# EAGLE design ProtoShieldShort (EAGLE 6.3)
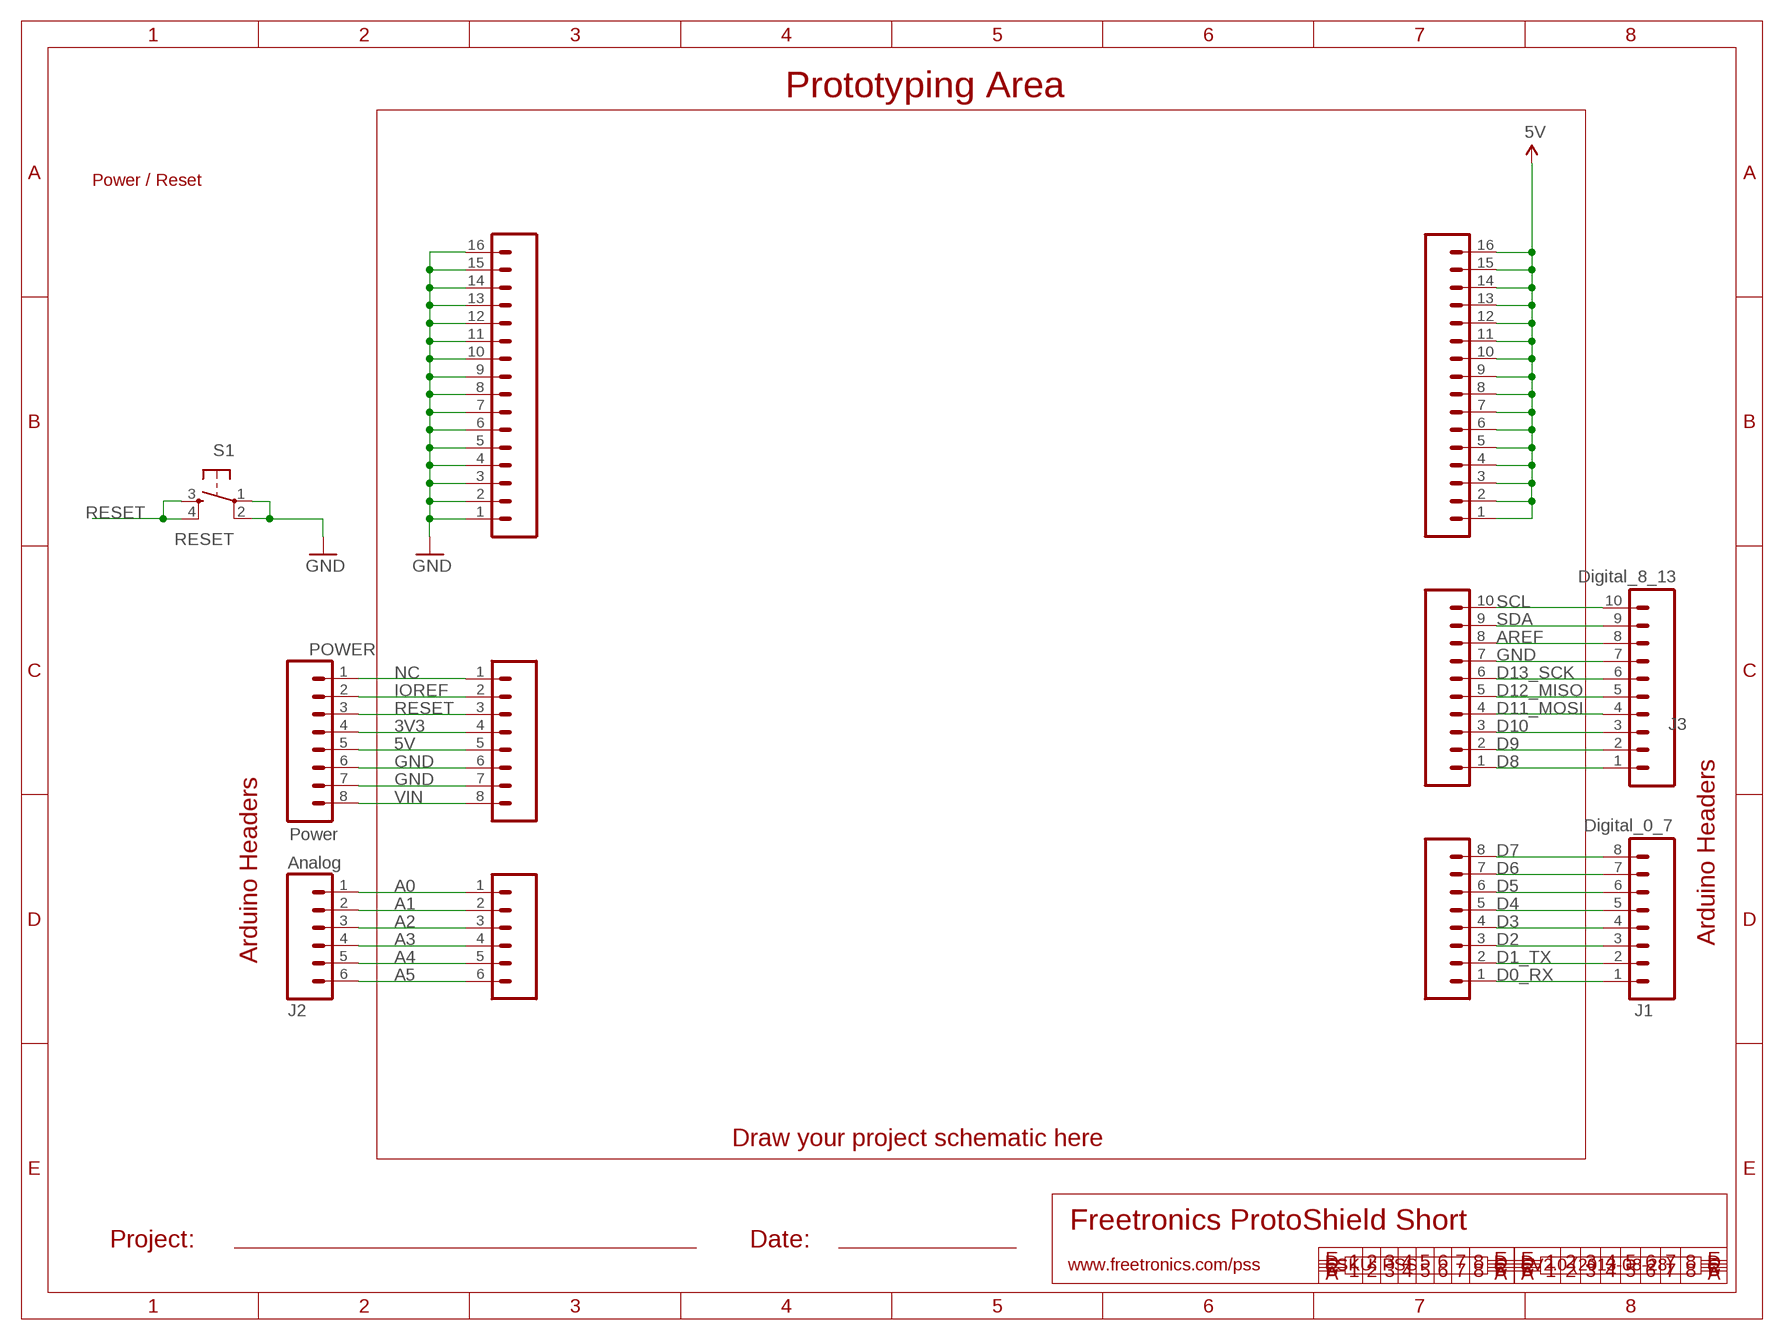
[diagram p0: schematic, sheet 1]

## Parts
J1  Digital_0_7  M08  [1X08]
J2  Analog  M06SIP  [1X06]
J3  Digital_8_13  M100.1  [1X10]
PADS_5V  M16PTH  [1X16]
PADS_GND  M16PTH  [1X16]
POWER  Power  M08  [1X08]
S1  RESET  TAC_SWITCHPTH  [TACTILE-PTH]
SL1  Digital_0_7  M08  [1X08]
SL2  Analog  M06SIP  [1X06]
SL3  Digital_8_13  M100.1  [1X10]
SLP  Power  M08  [1X08]

## Nets
3V3: POWER.4 SLP.4
5V: PADS_5V.1 PADS_5V.2 PADS_5V.3 PADS_5V.4 PADS_5V.5 PADS_5V.6 PADS_5V.7 PADS_5V.8 PADS_5V.9 PADS_5V.10 PADS_5V.11 PADS_5V.12 PADS_5V.13 PADS_5V.14 PADS_5V.15 PADS_5V.16 POWER.5 SLP.5
A0: J2.1 SL2.1
A1: J2.2 SL2.2
A2: J2.3 SL2.3
A3: J2.4 SL2.4
A4: J2.5 SL2.5
A5: J2.6 SL2.6
AREF: J3.8 SL3.8
D0_RX: J1.1 SL1.1
D1_TX: J1.2 SL1.2
D2: J1.3 SL1.3
D3: J1.4 SL1.4
D4: J1.5 SL1.5
D5: J1.6 SL1.6
D6: J1.7 SL1.7
D7: J1.8 SL1.8
D8: J3.1 SL3.1
D9: J3.2 SL3.2
D10: J3.3 SL3.3
D11_MOSI: J3.4 SL3.4
D12_MISO: J3.5 SL3.5
D13_SCK: J3.6 SL3.6
GND: J3.7 PADS_GND.1 PADS_GND.2 PADS_GND.3 PADS_GND.4 PADS_GND.5 PADS_GND.6 PADS_GND.7 PADS_GND.8 PADS_GND.9 PADS_GND.10 PADS_GND.11 PADS_GND.12 PADS_GND.13 PADS_GND.14 PADS_GND.15 PADS_GND.16 POWER.6 POWER.7 S1.1 S1.2 SL3.7 SLP.6 SLP.7
IOREF: POWER.2 SLP.2
NC: POWER.1 SLP.1
RESET: POWER.3 S1.3 S1.4 SLP.3
SCL: J3.10 SL3.10
SDA: J3.9 SL3.9
VIN: POWER.8 SLP.8

## Notes on the sheet
- Prototyping Area
- Power / Reset
- Arduino Headers
- Arduino Headers
- Draw your project schematic here
- Freetronics ProtoShield Short
- Project: | Date:
- www.freetronics.com/pss | SKU: PSS | V2.0 (2013-08-28)

## Library data of the parts
J1 POWER SL1 SLP = freetronics:M08: Header 8 Standard 8-pin 0.1" header. Use with straight break away headers (SKU : PRT-00116), right angle break away headers (PRT-00553), swiss pins (PRT-00743), machine pins (PRT-00117), and female headers (PRT-00115).
J2 SL2 = freetronics:M06: Header 6 Standard 6-pin 0.1" header. Use with straight break away headers (SKU : PRT-00116), right angle break away headers (PRT-00553), swiss pins (PRT-00743), machine pins (PRT-00117), and female headers (PRT-00115). Molex polarized connector foot print use with SKU : PRT-08094 with associated crimp pins and housings. NOTES ON THE VARIANTS LOCK and LOCK_LONGPADS... This footprint was designed to help hold the alignment of a through-hole component (i.e. 6-pin header) while soldering it into place. You may notice that each hole has been shifted either up or down by 0.005 of an inch from it's more standard position (which is a perfectly straight line). This slight alteration caused the pins (the squares in the middle) to touch the edges of the holes. Because they are alternating, it causes a "brace" to hold the component in place. 0.005 has proven to be the perfect amount of "off-center" position when using our standard breakaway headers. Although looks a little odd when you look at the bare footprint, once you have a header in there, the alteration is very hard to notice. Also, if you push a header all the way into place, it is covered up entirely on the bottom side. This idea of altering the position of holes to aid alignment will be further integrated into the Sparkfun Library for other footprints. It can help hold any component with 3 or more connection pins.
J3 SL3 = freetronics-original:M10: Header 10 Standard 10-pin 0.1" header. Use with straight break away headers (SKU : PRT-00116), right angle break away headers (PRT-00553), swiss pins (PRT-00743), machine pins (PRT-00117), and female headers (PRT-00115).
PADS_5V PADS_GND = freetronics-original:M16
S1 = freetronics:TAC_SWITCH: Momentary Switch Button commonly used for reset or general input. Spark Fun Electronics SKU : COM-00097

## Board
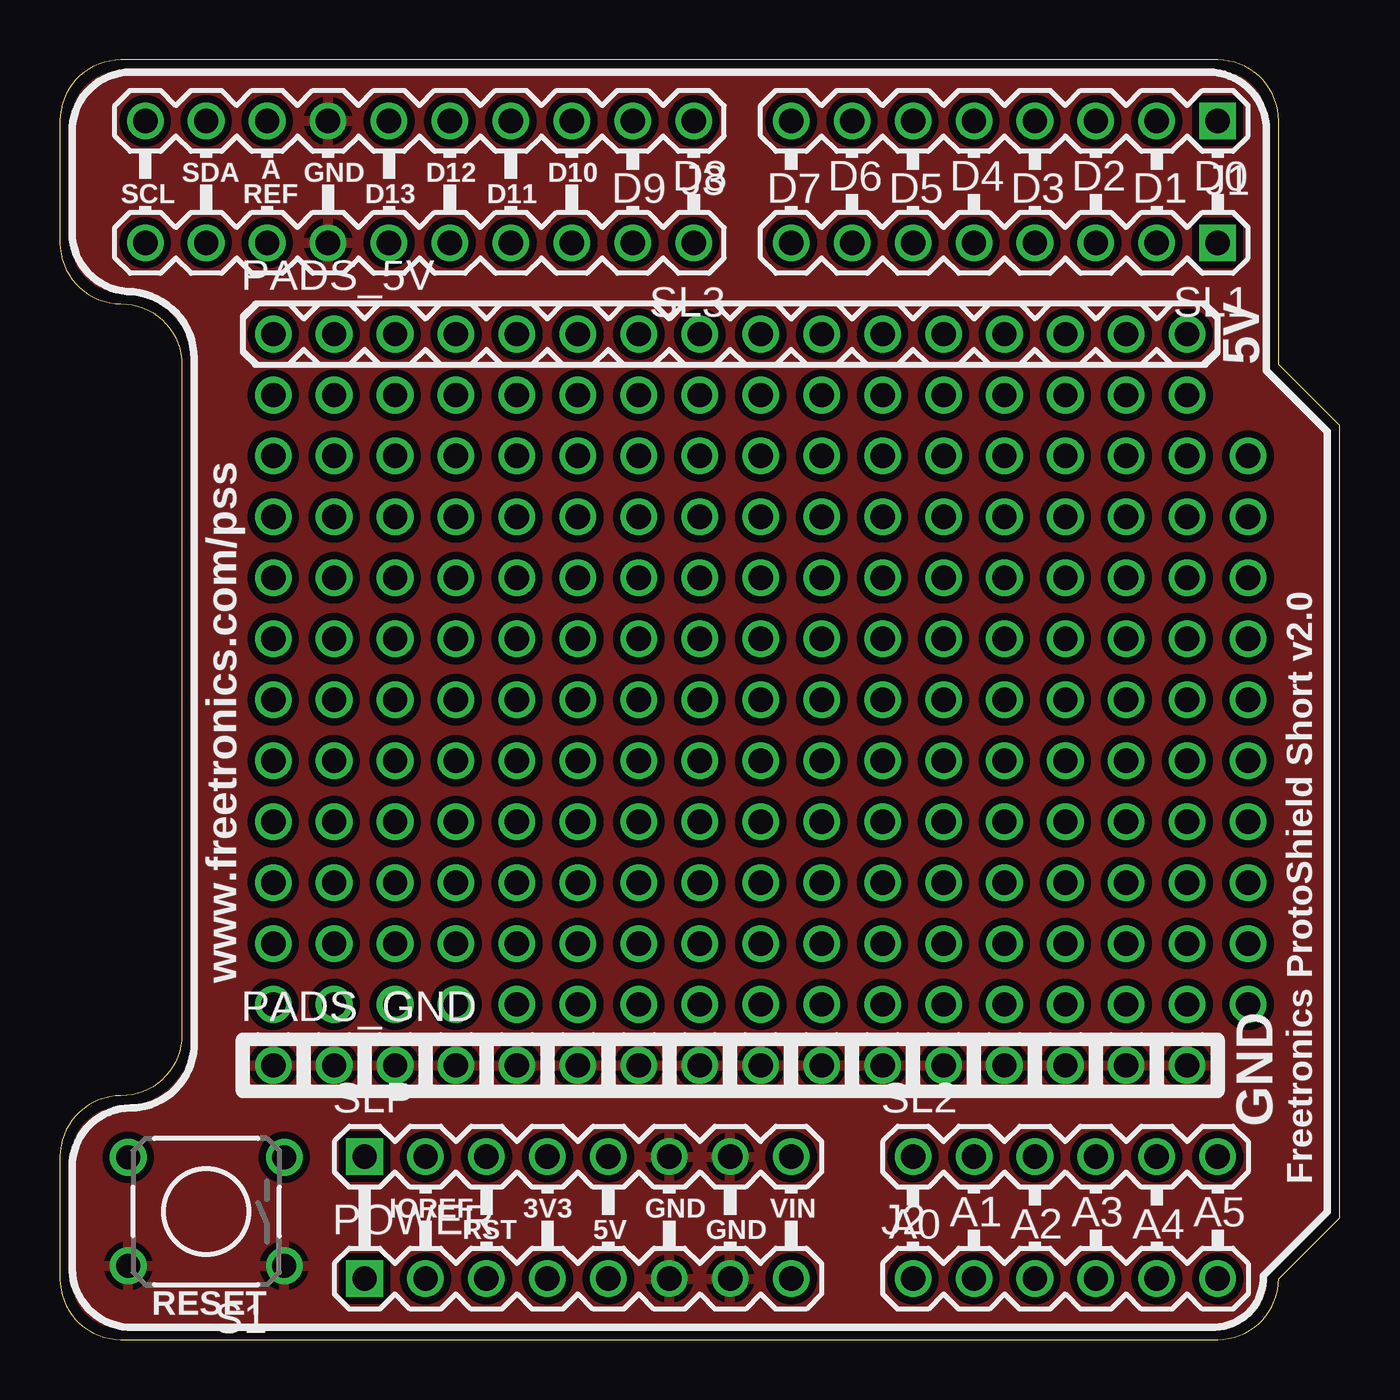
[diagram p1: board, top side]
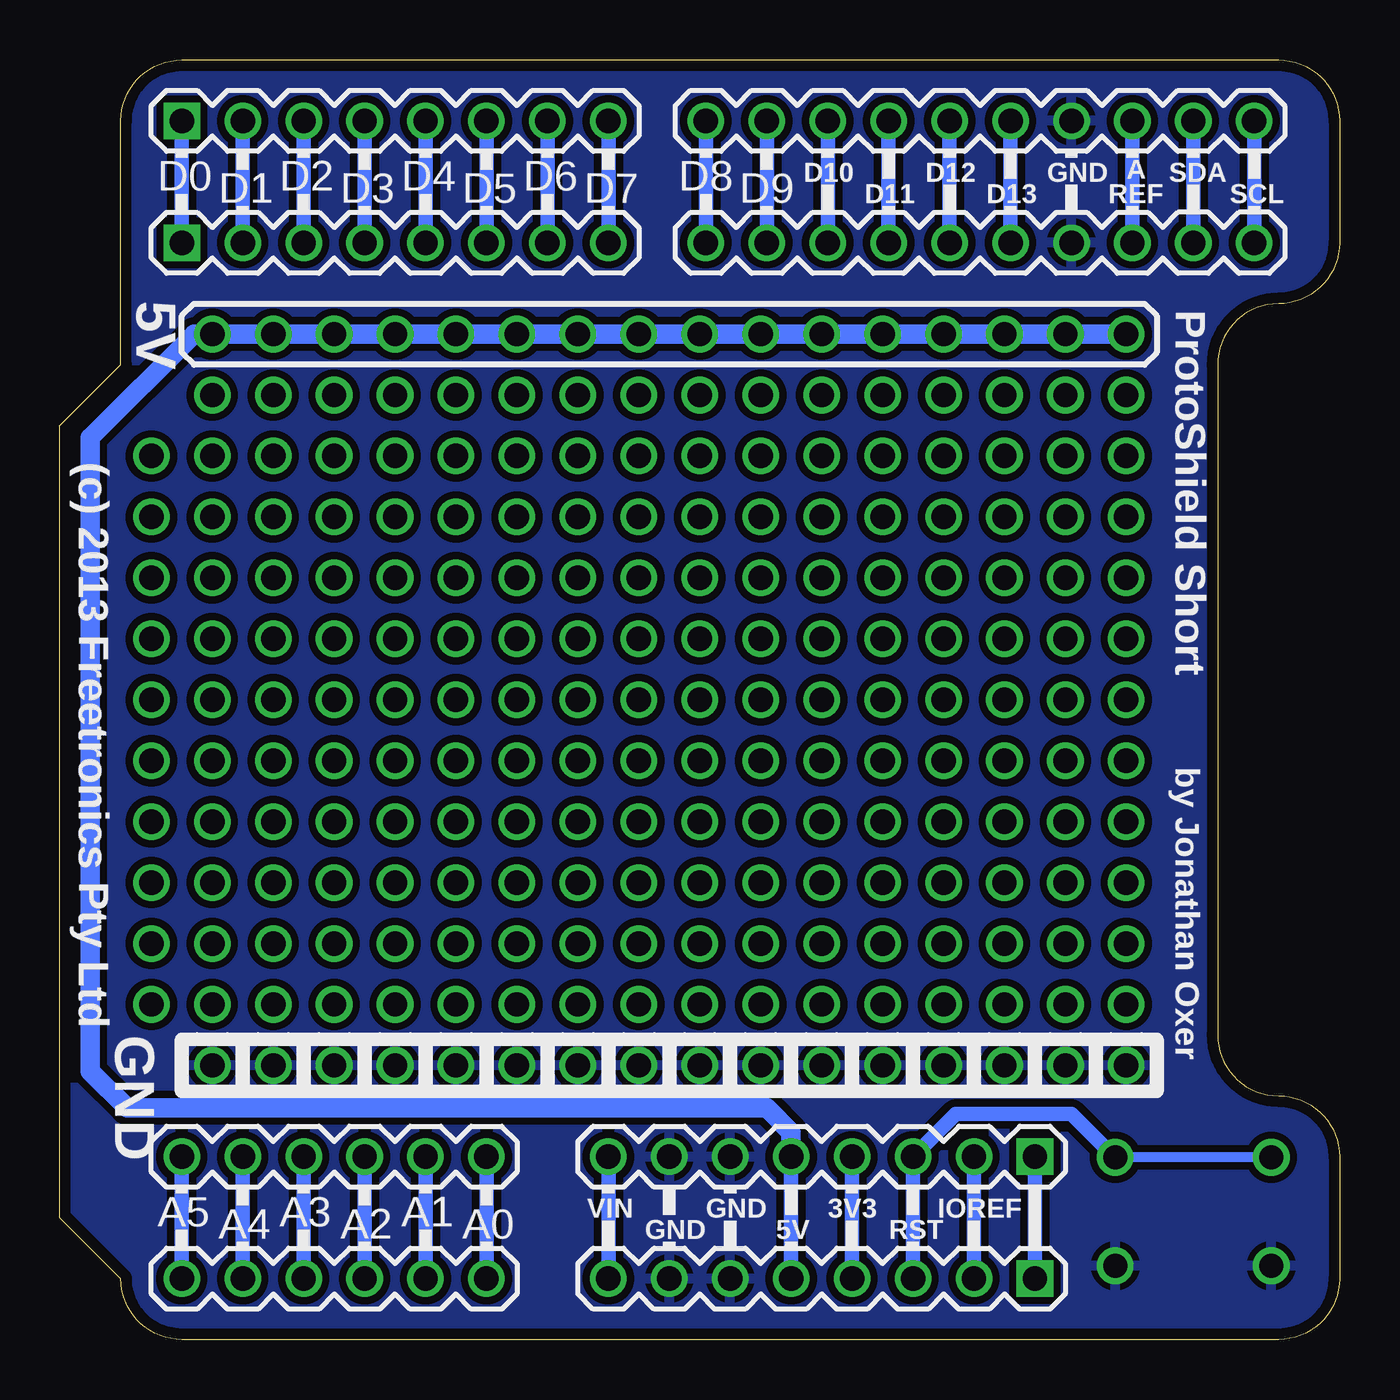
[diagram p2: board, bottom side, seen from below]

Size 53.34 x 53.34 mm. Coordinates in mm from the lower left corner, seen from the top.
Outline: 0,2.54 arc90 2.54,0 48.26,0 arc90 50.8,2.54 53.34,5.08 53.34,38.1 50.8,40.64 50.8,50.8 arc90 48.26,53.34 2.54,53.34 arc90 0,50.8 0,45.72 arc90 2.54,43.18 arc-90 5.08,40.64 5.08,12.7 arc-90 2.54,10.16 arc90 0,7.62 0,2.54
Copper layers (1*16): Top 0.035mm / dielectric 1.5mm / Bottom 0.035mm
Design rules "default *": minimum track width 10mil, minimum drill 24mil, track to track 12mil, track to pad 12mil, pad to pad 12mil, via to via 12mil, smd to smd 8mil, copper to edge 18mil, drill to drill 8mil, minimum pad ring 10mil, minimum via ring 8mil, stop-mask expansion 4mil, vias tented up to drill 0mil, thermal gap 10mil

### Footprints (pad centres in the part's own frame; a part is rotated, then mirrored left to right if it is on the bottom)
1X08 = drill 1.016 square: 1 0,0 | drill 1.016: 2 2.54,0; 3 5.08,0; 4 7.62,0; 5 10.16,0; 6 12.7,0; 7 15.24,0; 8 17.78,0
1X06 = drill 1.016: 1 0,0; 2 2.54,0; 3 5.08,0; 4 7.62,0; 5 10.16,0; 6 12.7,0
1X10 = drill 1.016: 1 0,0; 2 2.54,0; 3 5.08,0; 4 7.62,0; 5 10.16,0; 6 12.7,0; 7 15.24,0; 8 17.78,0; 9 20.32,0; 10 22.86,0
1X16 = drill 1.016: 1 0,0; 2 2.54,0; 3 5.08,0; 4 7.62,0; 5 10.16,0; 6 12.7,0; 7 15.24,0; 8 17.78,0; 9 20.32,0; 10 22.86,0; 11 25.4,0; 12 27.94,0; 13 30.48,0; 14 33.02,0; 15 35.56,0; 16 38.1,0
TACTILE-PTH = drill 1.016: 1 -3.251,2.261; 2 3.251,2.261; 3 -3.251,-2.261; 4 3.251,-2.261

### Placement (x,y rotation side)
J1  48.26,50.8 180 top
J2  35.56,2.54 0 top
J3  26.42,50.8 180 top
PADS_5V  8.89,41.91 0 top
PADS_GND  8.89,11.43 0 top
POWER  12.7,2.54 0 top
S1  6.1,5.33 180 top
SL1  48.26,45.72 180 top
SL2  35.56,7.62 0 top
SL3  26.42,45.72 180 top
SLP  12.7,7.62 0 top

### Tracks (layer width: path | path; a pad name or v marks a point on that pad's centre or on a via)
3V3
  Bottom 0.61: SLP.4 POWER.4
5V
  Bottom 0.61: POWER.5 SLP.5
  Bottom 0.813: PADS_5V.1 PADS_5V.2 PADS_5V.3 PADS_5V.4 PADS_5V.5 PADS_5V.6 PADS_5V.7 PADS_5V.8 PADS_5V.9 PADS_5V.10 PADS_5V.11 PADS_5V.12 PADS_5V.13 PADS_5V.14 PADS_5V.15 PADS_5V.16 47.75,41.91 52.07,37.59 52.07,11.18 50.55,9.65 23.88,9.65 22.86,8.64 SLP.5
A0
  Bottom 0.61: J2.1 SL2.1
A1
  Bottom 0.61: J2.2 SL2.2
A2
  Bottom 0.61: J2.3 SL2.3
A3
  Bottom 0.61: J2.4 SL2.4
A4
  Bottom 0.61: J2.5 SL2.5
A5
  Bottom 0.61: J2.6 SL2.6
AREF
  Bottom 0.61: SL3.8 J3.8
D0_RX
  Bottom 0.61: SL1.1 J1.1
D1_TX
  Bottom 0.61: SL1.2 J1.2
D2
  Bottom 0.61: SL1.3 J1.3
D3
  Bottom 0.61: SL1.4 J1.4
D4
  Bottom 0.61: SL1.5 J1.5
D5
  Bottom 0.61: SL1.6 J1.6
D6
  Bottom 0.61: SL1.7 J1.7
D7
  Bottom 0.61: SL1.8 J1.8
D8
  Bottom 0.61: SL3.1 J3.1
D9
  Bottom 0.61: SL3.2 J3.2
D10
  Bottom 0.61: SL3.3 J3.3
D11_MOSI
  Bottom 0.61: SL3.4 J3.4
D12_MISO
  Bottom 0.61: SL3.5 J3.5
D13_SCK
  Bottom 0.61: SL3.6 J3.6
GND
  pour Bottom: 0,50.8 arc-74 2.54,53.34 48.26,53.34 arc-74 50.8,50.8 50.8,40.64 53.34,38.1 53.34,5.08 50.8,2.54 arc-74 48.26,0 2.54,0 arc-74 0,2.54 0,7.62 arc-90 2.54,10.16 arc90 5.08,12.7 5.08,40.64 arc90 2.54,43.18 arc-90 0,45.72
  pour Top: 0,50.8 arc-74 2.54,53.34 48.26,53.34 arc-74 50.8,50.8 50.8,40.64 53.34,38.1 53.34,5.08 50.8,2.54 arc-74 48.26,0 2.54,0 arc-74 0,2.54 0,7.62 arc-90 2.54,10.16 arc90 5.08,12.7 5.08,40.64 arc90 2.54,43.18 arc-90 0,45.72
IOREF
  Bottom 0.61: POWER.2 SLP.2
N$5  (via drill 1.02)
  other vias: 44.45,13.97
N$7  (via drill 1.02)
  other vias: 41.91,13.97
N$8  (via drill 1.02)
  other vias: 39.37,13.97
N$9  (via drill 1.02)
  other vias: 36.83,13.97
N$10  (via drill 1.02)
  other vias: 34.29,13.97
N$11  (via drill 1.02)
  other vias: 31.75,13.97
N$12  (via drill 1.02)
  other vias: 29.21,13.97
N$13  (via drill 1.02)
  other vias: 26.67,13.97
N$14  (via drill 1.02)
  other vias: 24.13,13.97
N$15  (via drill 1.02)
  other vias: 21.59,13.97
N$16  (via drill 1.02)
  other vias: 19.05,13.97
N$17  (via drill 1.02)
  other vias: 16.51,13.97
N$18  (via drill 1.02)
  other vias: 13.97,13.97
N$19  (via drill 1.02)
  other vias: 11.43,13.97
N$20  (via drill 1.02)
  other vias: 8.89,13.97
N$22  (via drill 1.02)
  other vias: 44.45,16.51
N$23  (via drill 1.02)
  other vias: 41.91,16.51
N$24  (via drill 1.02)
  other vias: 39.37,16.51
N$25  (via drill 1.02)
  other vias: 36.83,16.51
N$26  (via drill 1.02)
  other vias: 34.29,16.51
N$27  (via drill 1.02)
  other vias: 31.75,16.51
N$28  (via drill 1.02)
  other vias: 29.21,16.51
N$29  (via drill 1.02)
  other vias: 26.67,16.51
N$30  (via drill 1.02)
  other vias: 24.13,16.51
N$31  (via drill 1.02)
  other vias: 21.59,16.51
N$32  (via drill 1.02)
  other vias: 19.05,16.51
N$33  (via drill 1.02)
  other vias: 16.51,16.51
N$34  (via drill 1.02)
  other vias: 13.97,16.51
N$35  (via drill 1.02)
  other vias: 11.43,16.51
N$36  (via drill 1.02)
  other vias: 8.89,16.51
N$38  (via drill 1.02)
  other vias: 44.45,19.05
N$39  (via drill 1.02)
  other vias: 41.91,19.05
N$40  (via drill 1.02)
  other vias: 39.37,19.05
N$41  (via drill 1.02)
  other vias: 36.83,19.05
N$42  (via drill 1.02)
  other vias: 34.29,19.05
N$43  (via drill 1.02)
  other vias: 31.75,19.05
N$44  (via drill 1.02)
  other vias: 29.21,19.05
N$45  (via drill 1.02)
  other vias: 26.67,19.05
N$46  (via drill 1.02)
  other vias: 24.13,19.05
N$47  (via drill 1.02)
  other vias: 21.59,19.05
N$48  (via drill 1.02)
  other vias: 19.05,19.05
N$49  (via drill 1.02)
  other vias: 16.51,19.05
N$50  (via drill 1.02)
  other vias: 13.97,19.05
N$51  (via drill 1.02)
  other vias: 11.43,19.05
N$52  (via drill 1.02)
  other vias: 8.89,19.05
N$54  (via drill 1.02)
  other vias: 44.45,21.59
N$55  (via drill 1.02)
  other vias: 41.91,21.59
N$56  (via drill 1.02)
  other vias: 39.37,21.59
N$57  (via drill 1.02)
  other vias: 36.83,21.59
N$58  (via drill 1.02)
  other vias: 34.29,21.59
N$59  (via drill 1.02)
  other vias: 31.75,21.59
N$60  (via drill 1.02)
  other vias: 29.21,21.59
N$61  (via drill 1.02)
  other vias: 26.67,21.59
N$62  (via drill 1.02)
  other vias: 24.13,21.59
N$63  (via drill 1.02)
  other vias: 21.59,21.59
N$64  (via drill 1.02)
  other vias: 19.05,21.59
N$65  (via drill 1.02)
  other vias: 16.51,21.59
N$66  (via drill 1.02)
  other vias: 13.97,21.59
N$67  (via drill 1.02)
  other vias: 11.43,21.59
N$68  (via drill 1.02)
  other vias: 8.89,21.59
N$70  (via drill 1.02)
  other vias: 44.45,24.13
N$71  (via drill 1.02)
  other vias: 41.91,24.13
N$72  (via drill 1.02)
  other vias: 39.37,24.13
N$73  (via drill 1.02)
  other vias: 36.83,24.13
N$74  (via drill 1.02)
  other vias: 34.29,24.13
N$75  (via drill 1.02)
  other vias: 31.75,24.13
N$76  (via drill 1.02)
  other vias: 29.21,24.13
N$77  (via drill 1.02)
  other vias: 26.67,24.13
N$78  (via drill 1.02)
  other vias: 24.13,24.13
N$79  (via drill 1.02)
  other vias: 21.59,24.13
N$80  (via drill 1.02)
  other vias: 19.05,24.13
N$81  (via drill 1.02)
  other vias: 16.51,24.13
N$82  (via drill 1.02)
  other vias: 13.97,24.13
N$83  (via drill 1.02)
  other vias: 11.43,24.13
N$84  (via drill 1.02)
  other vias: 8.89,24.13
N$86  (via drill 1.02)
  other vias: 44.45,26.67
N$87  (via drill 1.02)
  other vias: 41.91,26.67
N$88  (via drill 1.02)
  other vias: 39.37,26.67
N$89  (via drill 1.02)
  other vias: 36.83,26.67
N$90  (via drill 1.02)
  other vias: 34.29,26.67
N$91  (via drill 1.02)
  other vias: 31.75,26.67
N$92  (via drill 1.02)
  other vias: 29.21,26.67
N$93  (via drill 1.02)
  other vias: 26.67,26.67
N$94  (via drill 1.02)
  other vias: 24.13,26.67
N$95  (via drill 1.02)
  other vias: 21.59,26.67
N$96  (via drill 1.02)
  other vias: 19.05,26.67
N$97  (via drill 1.02)
  other vias: 16.51,26.67
N$98  (via drill 1.02)
  other vias: 13.97,26.67
N$99  (via drill 1.02)
  other vias: 11.43,26.67
N$100  (via drill 1.02)
  other vias: 8.89,26.67
N$102  (via drill 1.02)
  other vias: 44.45,29.21
N$103  (via drill 1.02)
  other vias: 41.91,29.21
N$104  (via drill 1.02)
  other vias: 39.37,29.21
N$105  (via drill 1.02)
  other vias: 36.83,29.21
N$106  (via drill 1.02)
  other vias: 34.29,29.21
N$107  (via drill 1.02)
  other vias: 31.75,29.21
N$108  (via drill 1.02)
  other vias: 29.21,29.21
N$109  (via drill 1.02)
  other vias: 26.67,29.21
N$110  (via drill 1.02)
  other vias: 24.13,29.21
N$111  (via drill 1.02)
  other vias: 21.59,29.21
N$112  (via drill 1.02)
  other vias: 19.05,29.21
N$113  (via drill 1.02)
  other vias: 16.51,29.21
N$114  (via drill 1.02)
  other vias: 13.97,29.21
N$115  (via drill 1.02)
  other vias: 11.43,29.21
N$116  (via drill 1.02)
  other vias: 8.89,29.21
N$118  (via drill 1.02)
  other vias: 44.45,31.75
N$119  (via drill 1.02)
  other vias: 41.91,31.75
N$120  (via drill 1.02)
  other vias: 39.37,31.75
N$121  (via drill 1.02)
  other vias: 36.83,31.75
N$122  (via drill 1.02)
  other vias: 34.29,31.75
N$123  (via drill 1.02)
  other vias: 31.75,31.75
N$124  (via drill 1.02)
  other vias: 29.21,31.75
N$125  (via drill 1.02)
  other vias: 26.67,31.75
N$126  (via drill 1.02)
  other vias: 24.13,31.75
N$127  (via drill 1.02)
  other vias: 21.59,31.75
N$128  (via drill 1.02)
  other vias: 19.05,31.75
N$129  (via drill 1.02)
  other vias: 16.51,31.75
N$130  (via drill 1.02)
  other vias: 13.97,31.75
N$131  (via drill 1.02)
  other vias: 11.43,31.75
N$132  (via drill 1.02)
  other vias: 8.89,31.75
N$134  (via drill 1.02)
  other vias: 44.45,34.29
N$135  (via drill 1.02)
  other vias: 41.91,34.29
N$136  (via drill 1.02)
  other vias: 39.37,34.29
N$137  (via drill 1.02)
  other vias: 36.83,34.29
N$138  (via drill 1.02)
  other vias: 34.29,34.29
N$139  (via drill 1.02)
  other vias: 31.75,34.29
N$140  (via drill 1.02)
  other vias: 29.21,34.29
N$141  (via drill 1.02)
  other vias: 26.67,34.29
N$142  (via drill 1.02)
  other vias: 24.13,34.29
N$143  (via drill 1.02)
  other vias: 21.59,34.29
N$144  (via drill 1.02)
  other vias: 19.05,34.29
N$145  (via drill 1.02)
  other vias: 16.51,34.29
N$146  (via drill 1.02)
  other vias: 13.97,34.29
N$147  (via drill 1.02)
  other vias: 11.43,34.29
N$148  (via drill 1.02)
  other vias: 8.89,34.29
N$150  (via drill 1.02)
  other vias: 44.45,36.83
N$151  (via drill 1.02)
  other vias: 41.91,36.83
N$152  (via drill 1.02)
  other vias: 39.37,36.83
N$153  (via drill 1.02)
  other vias: 36.83,36.83
N$154  (via drill 1.02)
  other vias: 34.29,36.83
N$155  (via drill 1.02)
  other vias: 31.75,36.83
N$156  (via drill 1.02)
  other vias: 29.21,36.83
N$157  (via drill 1.02)
  other vias: 26.67,36.83
N$158  (via drill 1.02)
  other vias: 24.13,36.83
N$159  (via drill 1.02)
  other vias: 21.59,36.83
N$160  (via drill 1.02)
  other vias: 19.05,36.83
N$161  (via drill 1.02)
  other vias: 16.51,36.83
N$162  (via drill 1.02)
  other vias: 13.97,36.83
N$163  (via drill 1.02)
  other vias: 11.43,36.83
N$164  (via drill 1.02)
  other vias: 8.89,36.83
N$166  (via drill 1.02)
  other vias: 44.45,39.37
N$167  (via drill 1.02)
  other vias: 41.91,39.37
N$168  (via drill 1.02)
  other vias: 39.37,39.37
N$169  (via drill 1.02)
  other vias: 36.83,39.37
N$170  (via drill 1.02)
  other vias: 34.29,39.37
N$171  (via drill 1.02)
  other vias: 31.75,39.37
N$172  (via drill 1.02)
  other vias: 29.21,39.37
N$173  (via drill 1.02)
  other vias: 26.67,39.37
N$174  (via drill 1.02)
  other vias: 24.13,39.37
N$175  (via drill 1.02)
  other vias: 21.59,39.37
N$176  (via drill 1.02)
  other vias: 19.05,39.37
N$177  (via drill 1.02)
  other vias: 16.51,39.37
N$178  (via drill 1.02)
  other vias: 13.97,39.37
N$179  (via drill 1.02)
  other vias: 11.43,39.37
N$180  (via drill 1.02)
  other vias: 8.89,39.37
N$182  (via drill 1.02)
  other vias: 46.99,13.97
N$183  (via drill 1.02)
  other vias: 46.99,16.51
N$184  (via drill 1.02)
  other vias: 46.99,19.05
N$185  (via drill 1.02)
  other vias: 46.99,21.59
N$186  (via drill 1.02)
  other vias: 46.99,24.13
N$187  (via drill 1.02)
  other vias: 46.99,26.67
N$188  (via drill 1.02)
  other vias: 46.99,29.21
N$189  (via drill 1.02)
  other vias: 46.99,31.75
N$190  (via drill 1.02)
  other vias: 46.99,34.29
N$191  (via drill 1.02)
  other vias: 46.99,36.83
N$193  (via drill 1.02)
  other vias: 49.53,13.97
N$194  (via drill 1.02)
  other vias: 49.53,16.51
N$195  (via drill 1.02)
  other vias: 49.53,19.05
N$196  (via drill 1.02)
  other vias: 49.53,21.59
N$197  (via drill 1.02)
  other vias: 49.53,24.13
N$198  (via drill 1.02)
  other vias: 49.53,26.67
N$199  (via drill 1.02)
  other vias: 49.53,29.21
N$200  (via drill 1.02)
  other vias: 49.53,31.75
N$201  (via drill 1.02)
  other vias: 49.53,34.29
N$202  (via drill 1.02)
  other vias: 49.53,36.83
N$203  (via drill 1.02)
  other vias: 46.99,39.37
NC
  Bottom 0.61: POWER.1 SLP.1
RESET
  Bottom 0.406: S1.4 S1.3
  Bottom 0.61: POWER.3 SLP.3 16,9.4 11.18,9.4 9.37,7.59 S1.3
SCL
  Bottom 0.61: J3.10 SL3.10
SDA
  Bottom 0.61: J3.9 SL3.9
VIN
  Bottom 0.61: SLP.8 POWER.8

### Text on the board
tPlace: SDA | A | GND | D12 | D10 | D8 | D6 | D4 | D2 | D0 | SCL | REF | D13 | D11 | D9 | D7 | D5 | D3 | D1 | 5V | www.freetronics.com/pss | GND | Freetronics ProtoShield Short v2.0 | IOREF | 3V3 | GND | VIN | A1 | A3 | A5 | RST | 5V | GND | A0 | A2 | A4 | RESET
bPlace: SDA | A | GND | D12 | D10 | D8 | D6 | D4 | D2 | D0 | SCL | REF | D13 | D11 | D9 | D7 | D5 | D3 | D1 | ProtoShield Short | 5V | (c) 2013 Freetronics Pty Ltd | by Jonathan Oxer | GND | IOREF | 3V3 | GND | VIN | A1 | A3 | A5 | RST | 5V | GND | A0 | A2 | A4